# EAGLE schematic untitled (EAGLE 6.6.0)
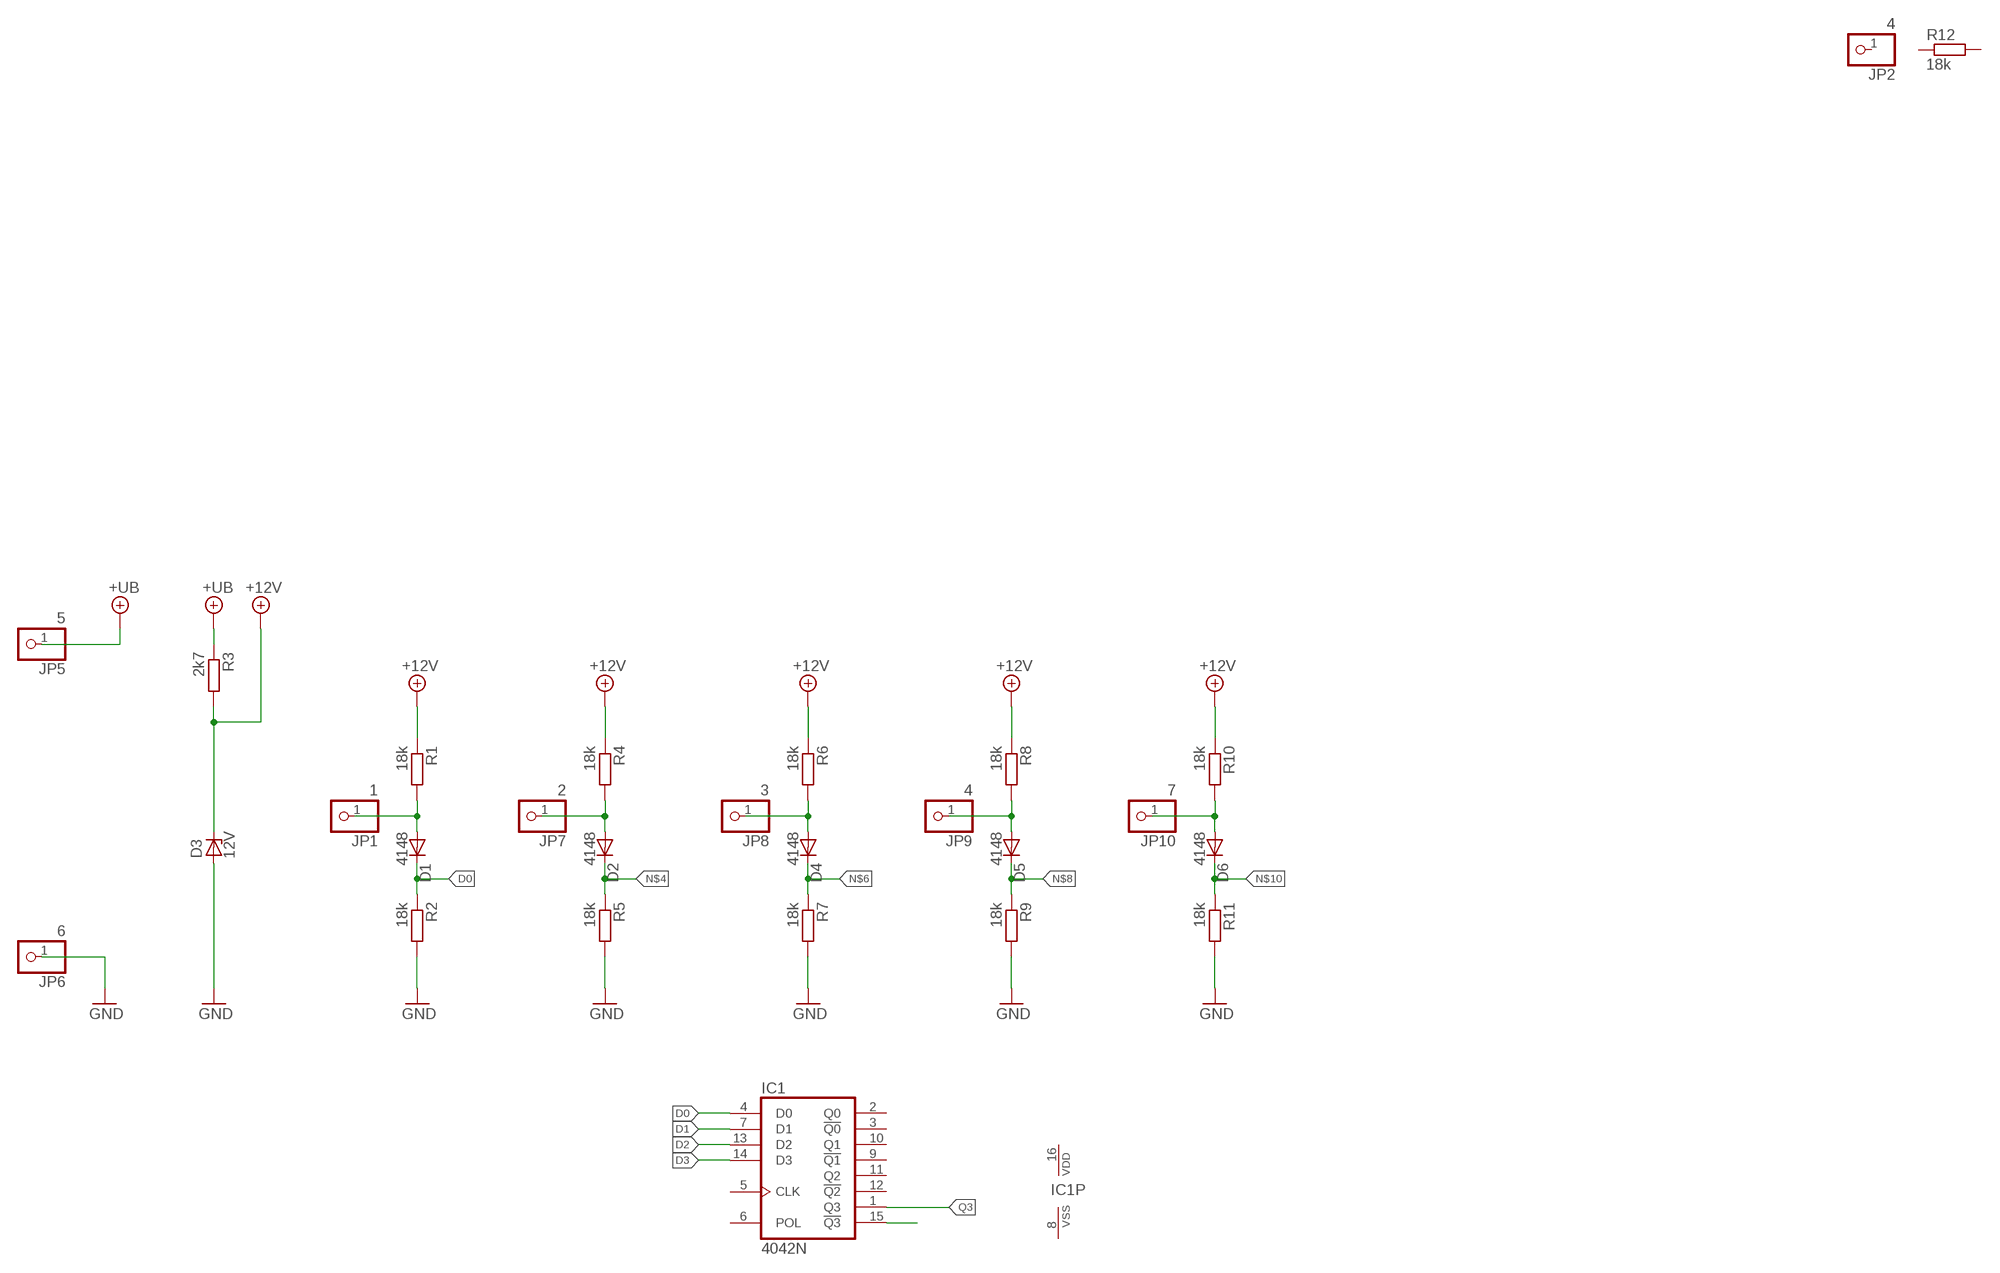
[diagram p0: schematic, sheet 1]

## Parts
D1  4148  1N4148DO35-7  [DO35-7]
D2  4148  1N4148DO35-7  [DO35-7]
D3  12V  BZV10  [DO34Z7]
D4  4148  1N4148DO35-7  [DO35-7]
D5  4148  1N4148DO35-7  [DO35-7]
D6  4148  1N4148DO35-7  [DO35-7]
IC1  4042N  [DIL16]
JP1  1  PINHD-1X1  [1X01]
JP2  4  PINHD-1X1  [1X01]
JP5  5  PINHD-1X1  [1X01]
JP6  6  PINHD-1X1  [1X01]
JP7  2  PINHD-1X1  [1X01]
JP8  3  PINHD-1X1  [1X01]
JP9  4  PINHD-1X1  [1X01]
JP10  7  PINHD-1X1  [1X01]
R1  18k  R-EU_0207/7  [0207/7]
R2  18k  R-EU_0207/7  [0207/7]
R3  2k7  R-EU_0207/7  [0207/7]
R4  18k  R-EU_0207/7  [0207/7]
R5  18k  R-EU_0207/7  [0207/7]
R6  18k  R-EU_0207/7  [0207/7]
R7  18k  R-EU_0207/7  [0207/7]
R8  18k  R-EU_0207/7  [0207/7]
R9  18k  R-EU_0207/7  [0207/7]
R10  18k  R-EU_0207/7  [0207/7]
R11  18k  R-EU_0207/7  [0207/7]
R12  18k  R-EU_0207/7  [0207/7]

## Nets
+12V: D3.C R1.1 R3.2 R4.1 R6.1 R8.1 R10.1
+UB: JP5.1 R3.1
D0: D1.C IC1.4(D0) R2.1
D1: IC1.7(D1)
D2: IC1.13(D2)
D3: IC1.14(D3)
GND: D3.A JP6.1 R2.2 R5.2 R7.2 R9.2 R11.2
N$1: D1.A JP1.1 R1.2
N$2: IC1.15(!Q3)
N$3: D2.A JP7.1 R4.2
N$4: D2.C R5.1
N$5: D4.A JP8.1 R6.2
N$6: D4.C R7.1
N$7: D5.A JP9.1 R8.2
N$8: D5.C R9.1
N$9: D6.A JP10.1 R10.2
N$10: D6.C R11.1
Q3: IC1.1(Q3)
Unconnected: IC1.2(Q0) IC1.3(!Q0) IC1.5(CLK) IC1.6(POL) IC1.9(!Q1) IC1.10(Q1) IC1.11(Q2) IC1.12(!Q2) JP2.1 R12.1 R12.2

## Power pins joined to a net without a drawn wire
VDD: IC1.16(VDD)
VSS: IC1.8(VSS)

## Library data of the parts
D1 D2 D4-D6 = diode:1N4148: DIODE high speed (Philips)
D3 = diode:BZV10: Z DIODE
IC1 = 40xx:4042: Quad clocked D LATCH
JP1 JP2 JP5-JP10 = pinhead:PINHD-1X1: PIN HEADER
R1-R12 = rcl:R-EU_: RESISTOR, European symbol